# EAGLE schematic ultrasonic_send (EAGLE 6.5.0)
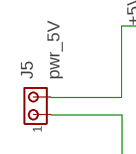
[diagram p0: schematic, sheet 1, part 1 of 2]
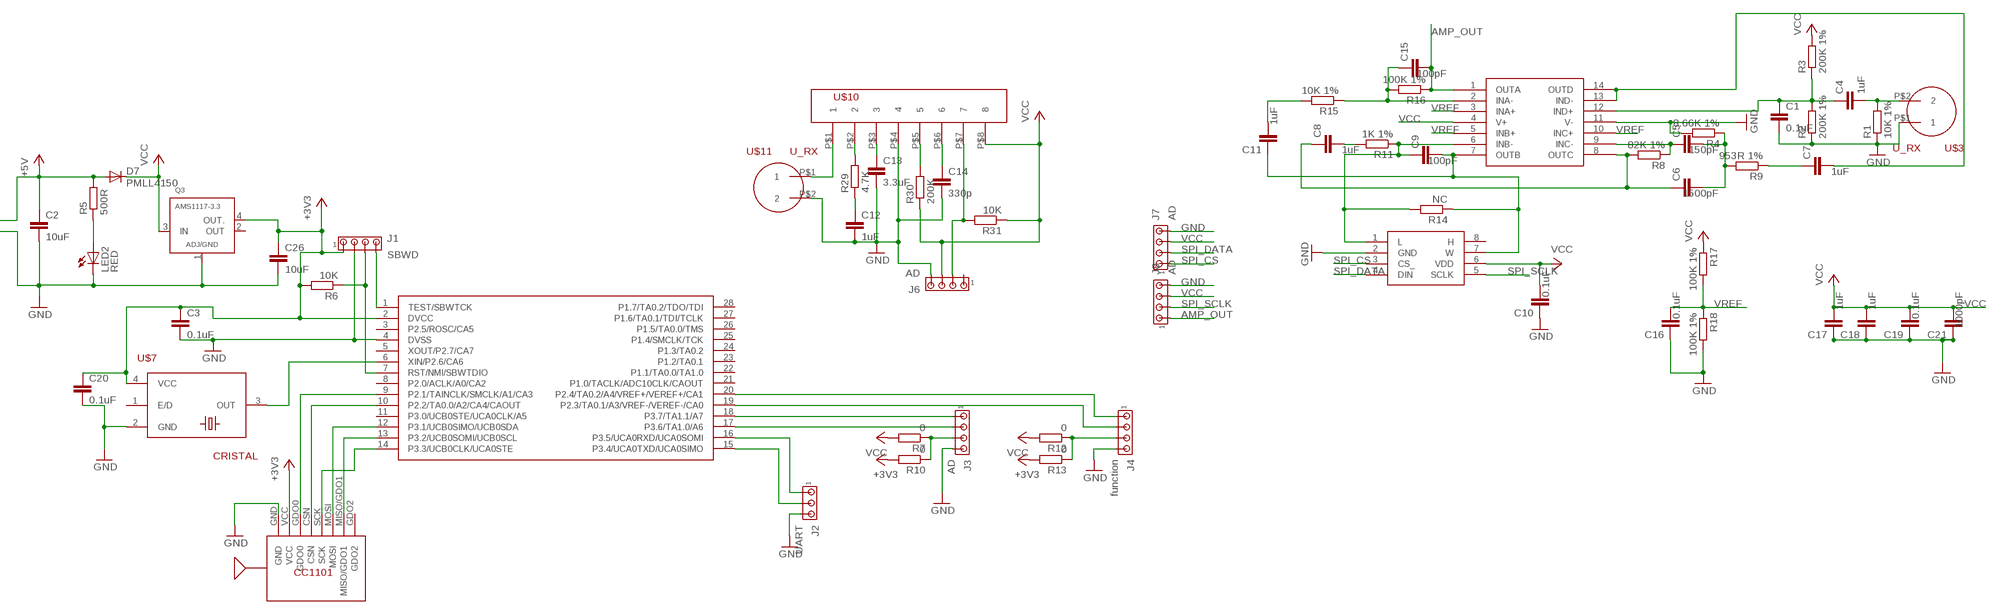
[diagram p1: schematic, sheet 1, part 2 of 2]

## Parts
C1  0.1uF  C-EUC0805  [C0805]
C2  10uF  C-EUC0805  [C0805]
C3  0.1uF  C-EUC0805  [C0805]
C4  1uF  C-EUC0805  [C0805]
C5  150pF  C-EUC0805  [C0805]
C6  1500pF  C-EUC0805  [C0805]
C7  1uF  C-EUC0805  [C0805]
C8  1uF  C-EUC0805  [C0805]
C9  100pF  C-EUC0805  [C0805]
C10  0.1uF  C-EUC0805  [C0805]
C11  1uF  C-EUC0805  [C0805]
C12  1uF  C-EUC0805  [C0805]
C13  3.3uF  C-EUC0805  [C0805]
C14  330p  C-EUC0805  [C0805]
C15  100pF  C-EUC0805  [C0805]
C16  0.1uF  C-EUC0805  [C0805]
C17  1uF  C-EUC0805  [C0805]
C18  1uF  C-EUC0805  [C0805]
C19  0.1uF  C-EUC0805  [C0805]
C20  0.1uF  C-EUC0805  [C0805]
C21  1000pF  C-EUC0805  [C0805]
C26  10uF  C-EUC0805  [C0805]
D7  PMLL4150  [SOD80C]
J1  SBWD  MTA04-100  [10X04MTA]
J2  UART  MTA03-100  [10X03MTA]
J3  AD  MTA04-100  [10X04MTA]
J4  function  MTA04-100  [10X04MTA]
J5  pwr_5V  MTA02-100  [10X02MTA]
J6  AD  MTA04-100  [10X04MTA]
J7  AD  MTA04-100  [10X04MTA]
J8  AD  MTA04-100  [10X04MTA]
LED2  RED  LEDSML0805  [SML0805]
Q3  AMS1117-3.3  TLV1117  [SOT223-4]
R1  10K 1%  R-EU_R0603  [R0603]
R2  200K 1%  R-EU_R0603  [R0603]
R3  200K 1%  R-EU_R0603  [R0603]
R4  8.66K 1%  R-EU_R0603  [R0603]
R5  500R  R-EU_R0603  [R0603]
R6  10K  R-EU_R0603  [R0603]
R7  0  R-EU_R0603  [R0603]
R8  82K 1%  R-EU_R0603  [R0603]
R9  953R 1%  R-EU_R0603  [R0603]
R10  0  R-EU_R0603  [R0603]
R11  1K 1%  R-EU_R0603  [R0603]
R12  0  R-EU_R0603  [R0603]
R13  0  R-EU_R0603  [R0603]
R14  NC  R-EU_R0603  [R0603]
R15  10K 1%  R-EU_R0603  [R0603]
R16  100K 1%  R-EU_R0603  [R0603]
R17  100K 1%  R-EU_R0603  [R0603]
R18  100K 1%  R-EU_R0603  [R0603]
R29  4.7K  R-EU_R0603  [R0603]
R30  200K  R-EU_R0603  [R0603]
R31  10K  R-EU_R0603  [R0603]
U$1  OPA1654PW  [D_R-PDSO-G14]
U$2  MSP430F2112  [PW_R-PDSO-G28]
U$3  U_RX  ULTRASONIC  [ULTRASONIC]
U$4  CC1101  [CC1101]
U$5  MAX5401EKA-T  [SO08]
U$7  CRISTAL  [CTS406]
U$10  CX20106  [CX20106]
U$11  U_RX  ULTRASONIC  [ULTRASONIC]

## Nets
+3V3: C3.1 C20.1 C26.1 J1.1 Q3.4(OUT.) R6.2 R10.2 R13.2 U$2.2(DVCC) U$4.VCC U$7.4(VCC)
+5V: C2.1 D7.A J5.2 R5.2
AMP_OUT: C15.2 J8.1 R16.1 U$1.1(OUTA)
GND: C1.2 C2.2 C3.2 C10.1 C12.2 C13.2 C14.2 C16.1 C17.1 C18.1 C19.1 C20.2 C21.1 C26.2 J1.2 J2.3 J3.4 J4.4 J5.1 J6.4 J7.4 J8.4 LED2.C Q3.1(ADJ/GND) R1.1 R2.1 R4.2 R18.2 U$1.11(V-) U$2.4(DVSS) U$3.P$1 U$4.GND U$5.2(GND) U$7.2(GND) U$10.P$4 U$11.P$2
N$1: C4.2 R1.2 U$3.P$2
N$2: C5.1 R8.1 U$1.9(INC-)
N$3: C1.1 C4.1 R2.2 R3.1 U$1.12(IND+)
N$4: C6.1 C8.1 R8.2 U$1.8(OUTC)
N$5: J1.4 U$2.1(TEST/SBWTCK)
N$6: LED2.A R5.1
N$7: U$2.6(XIN/P2.6/CA6) U$7.3(OUT)
N$8: C5.2 C6.2 R4.1 R9.2
N$9: J4.3 R12.1 R13.1
N$10: J1.3 R6.1 U$2.7(RST/NMI/SBWTDIO)
N$11: U$2.9(P2.1/TAINCLK/SMCLK/A1/CA3) U$4.GDO0
N$12: U$2.10(P2.2/TA0.0/A2/CA4/CAOUT) U$4.CSN
N$13: U$2.12(P3.1/UCB0SIMO/UCB0SDA) U$4.MOSI
N$14: U$2.13(P3.2/UCB0SOMI/UCB0SCL) U$4.MISO/GDO1
N$15: U$2.14(P3.3/UCB0CLK/UCA0STE) U$4.SCK
N$16: J2.1 U$2.16(P3.5/UCA0RXD/UCA0SOMI)
N$17: J2.2 U$2.15(P3.4/UCA0TXD/UCA0SIMO)
N$18: J3.1 U$2.18(P3.7/TA1.1/A7)
N$19: J3.2 U$2.17(P3.6/TA1.0/A6)
N$20: J3.3 R7.1 R10.1
N$21: C7.1 R9.1
N$22: C7.2 U$1.13(IND-) U$1.14(OUTD)
N$23: C9.1 R11.1 R14.2 U$1.6(INB-) U$5.1(L)
N$24: C9.2 C11.1 R14.1 U$1.7(OUTB) U$5.7(W)
N$25: C8.2 R11.2
N$26: C11.2 R15.2
N$27: C15.1 R15.1 R16.2 U$1.2(INA-)
N$42: J4.1 U$2.20(P2.4/TA0.2/A4/VREF+/VEREF+/CA1)
N$47: R29.2 U$10.P$2
N$48: C12.1 R29.1
N$49: U$10.P$1 U$11.P$1
N$50: C13.1 U$10.P$3
N$51: J6.2 R31.2 U$10.P$7
N$52: R30.2 U$10.P$5
N$53: C14.1 U$10.P$6
N$56: J4.2 U$2.19(P2.3/TA0.1/A3/VREF-/VEREF-/CA0)
SPI_CS: J7.1 U$5.3(CS_)
SPI_DATA: J7.2 U$5.4(DIN)
SPI_SCLK: J8.2 U$5.5(SCLK)
VCC: C10.2 C17.2 C18.2 C19.2 C21.2 D7.C J6.3 J7.3 J8.3 Q3.3(IN) R3.2 R7.2 R12.2 R17.1 R30.1 R31.1 U$1.4(V+) U$5.6(VDD) U$10.P$8
VREF: C16.2 R17.2 R18.1 U$1.3(INA+) U$1.5(INB+) U$1.10(INC+)
Unconnected: J6.1 U$2.3(P2.5/ROSC/CA5) U$2.5(XOUT/P2.7/CA7) U$2.8(P2.0/ACLK/A0/CA2) U$2.11(P3.0/UCB0STE/UCA0CLK/A5) U$2.21(P1.0/TACLK/ADC10CLK/CAOUT) U$2.22(P1.1/TA0.0/TA1.0) U$2.23(P1.2/TA0.1) U$2.24(P1.3/TA0.2) U$2.25(P1.4/SMCLK/TCK) U$2.26(P1.5/TA0.0/TMS) U$2.27(P1.6/TA0.1/TDI/TCLK) U$2.28(P1.7/TA0.2/TDO/TDI) U$4.GDO2 U$5.8(H) U$7.1(E/D)

## Power pins joined to a net without a drawn wire
OUT: Q3.2(OUT)

## Library data of the parts
C1-C21 C26 = resistor:C-EU: CAPACITOR, European symbol
D7 = diode:PMLL4150: DIODE high speed
J1 J3 J4 J6-J8 = con-amp:MTA04-100: AMP connector
J2 = con-amp:MTA03-100: AMP connector
J5 = con-amp:MTA02-100: AMP connector
LED2 = led:LED: LED OSRAM: - CHIPLED LG R971, LG N971, LY N971, LG Q971, LY Q971, LO R971, LY R971 LH N974, LH R974 LS Q976, LO Q976, LY Q976 LO Q996 - Hyper CHIPLED LW Q18S LB Q993, LB Q99A, LB R99A - SideLED LS A670, LO A670, LY A670, LG A670, LP A670 LB A673, LV A673, LT A673, LW A673 LH A674 LY A675 LS A676, LA A676, LO A676, LY A676, LW A676 LS A679, LY A679, LG A679 - Hyper Micro SIDELED® LS Y876, LA Y876, LO Y876, LY Y876 LT Y87S - SmartLED LW L88C, LW L88S LB L89C, LB L89S, LG L890 LS L89K, LO L89K, LY L89K LS L896, LA L896, LO L896, LY L896 - TOPLED LS T670, LO T670, LY T670, LG T670, LP T670 LSG T670, LSP T670, LSY T670, LOP T670, LYG T670 LG T671, LOG T671, LSG T671 LB T673, LV T673, LT T673, LW T673 LH T674 LS T676, LA T676, LO T676, LY T676, LB T676, LH T676, LSB T676, LW T676 LB T67C, LV T67C, LT T67C, LS T67K, LO T67K, LY T67K, LW E67C LS E67B, LA E67B, LO E67B, LY E67B, LB E67C, LV E67C, LT E67C LW T67C LS T679, LY T679, LG T679 LS T770, LO T770, LY T770, LG T770, LP T770 LB T773, LV T773, LT T773, LW T773 LH T774 LS E675, LA E675, LY E675, LS T675 LS T776, LA T776, LO T776, LY T776, LB T776 LHGB T686 LT T68C, LB T68C - Hyper Mini TOPLED® LB M676 - Mini TOPLED Santana® LG M470 LS M47K, LO M47K, LY M47K Source: http://www.osram.convergy.de LUXEON: - LUMILED® LXK2-PW12-R00, LXK2-PW12-S00, LXK2-PW14-U00, LXK2-PW14-V00 LXK2-PM12-R00, LXK2-PM12-S00, LXK2-PM14-U00 LXK2-PE12-Q00, LXK2-PE12-R00, LXK2-PE12-S00, LXK2-PE14-T00, LXK2-PE14-U00 LXK2-PB12-K00, LXK2-PB12-L00, LXK2-PB12-M00, LXK2-PB14-N00, LXK2-PB14-P00, LXK2-PB14-Q00 LXK2-PR12-L00, LXK2-PR12-M00, LXK2-PR14-Q00, LXK2-PR14-R00 LXK2-PD12-Q00, LXK2-PD12-R00, LXK2-PD12-S00 LXK2-PH12-R00, LXK2-PH12-S00 LXK2-PL12-P00, LXK2-PL12-Q00, LXK2-PL12-R00 Source: www.luxeon.com KINGBRIGHT: KA-3528ASYC Source: www.kingbright.com
Q3 = ti-parts:TLV1117: LDO VOLTAGE REGULATOR
R1-R18 R29-R31 = resistor:R-EU_: RESISTOR, European symbol
U$1 = tofu:OPA1654PW: TI Low Noise and Distortion, General-Purpose, FET-Input AUDIO OPERATIONAL AMPLIFIERS
U$2 = tofu:MSP430F2112
U$3 U$11 = tofu:ULTRASONIC
U$4 = tofu:CC1101
U$5 = tofu:MAX5401EKA-T
U$7 = tofu:CRISTAL
U$10 = tofu:CX20106